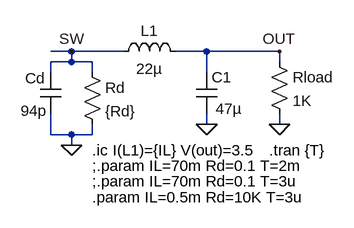
[diagram p0: schematic StepDownRevers1.asc]
StepDownRevers1.asc, the LTspice schematic file:
Version 4
SHEET 1 2900 1300
WIRE 2288 976 2256 976
WIRE 2368 976 2288 976
WIRE 2496 976 2448 976
WIRE 2608 976 2496 976
WIRE 2288 992 2288 976
WIRE 2288 992 2256 992
WIRE 2320 992 2288 992
WIRE 2608 992 2608 976
WIRE 2256 1008 2256 992
WIRE 2320 1008 2320 992
WIRE 2496 1008 2496 976
WIRE 2496 1088 2496 1072
WIRE 2608 1088 2608 1072
WIRE 2256 1104 2256 1072
WIRE 2288 1104 2256 1104
WIRE 2320 1104 2320 1088
WIRE 2320 1104 2288 1104
WIRE 2288 1120 2288 1104
FLAG 2288 1120 0
FLAG 2496 1088 0
FLAG 2608 1088 0
FLAG 2608 976 OUT
FLAG 2288 976 SW
SYMBOL ind 2352 992 R270
WINDOW 0 32 56 VTop 0
WINDOW 3 5 56 VBottom 0
SYMATTR InstName L1
SYMATTR Value 22µ
SYMATTR SpiceLine Rpar=10k
SYMBOL cap 2480 1008 R0
WINDOW 123 31 81 Left 0
WINDOW 3 30 56 Left 0
SYMATTR Value 47µ
SYMATTR InstName C1
SYMBOL res 2592 976 R0
SYMATTR InstName Rload
SYMATTR Value 1K
SYMBOL res 2304 992 R0
SYMATTR InstName Rd
SYMATTR Value {Rd}
SYMBOL cap 2240 1008 R0
WINDOW 0 -23 9 Left 0
WINDOW 3 -30 59 Left 0
SYMATTR InstName Cd
SYMATTR Value 94p
TEXT 2592 1128 Left 0 !.tran {T}
TEXT 2320 1128 Left 0 !.ic I(L1)={IL} V(out)=3.5
TEXT 2320 1176 Left 0 !;.param IL=70m Rd=0.1 T=3u
TEXT 2320 1152 Left 0 !;.param IL=70m Rd=0.1 T=2m
TEXT 2320 1200 Left 0 !.param IL=0.5m Rd=10K T=3u

The netlist it stands for:
* StepDownRevers1.asc
L1 SW OUT 22µ Rpar=10k
C1 OUT 0 47µ
Rload OUT 0 1K
Rd SW 0 {Rd}
Cd SW 0 94p
.tran {T}
.ic I(L1)={IL} V(out)=3.5
;.param IL=70m Rd=0.1 T=3u
;.param IL=70m Rd=0.1 T=2m
.param IL=0.5m Rd=10K T=3u
.backanno
.end